# EAGLE design ANGEL II Type III_ver2 (EAGLE 7.4.0)
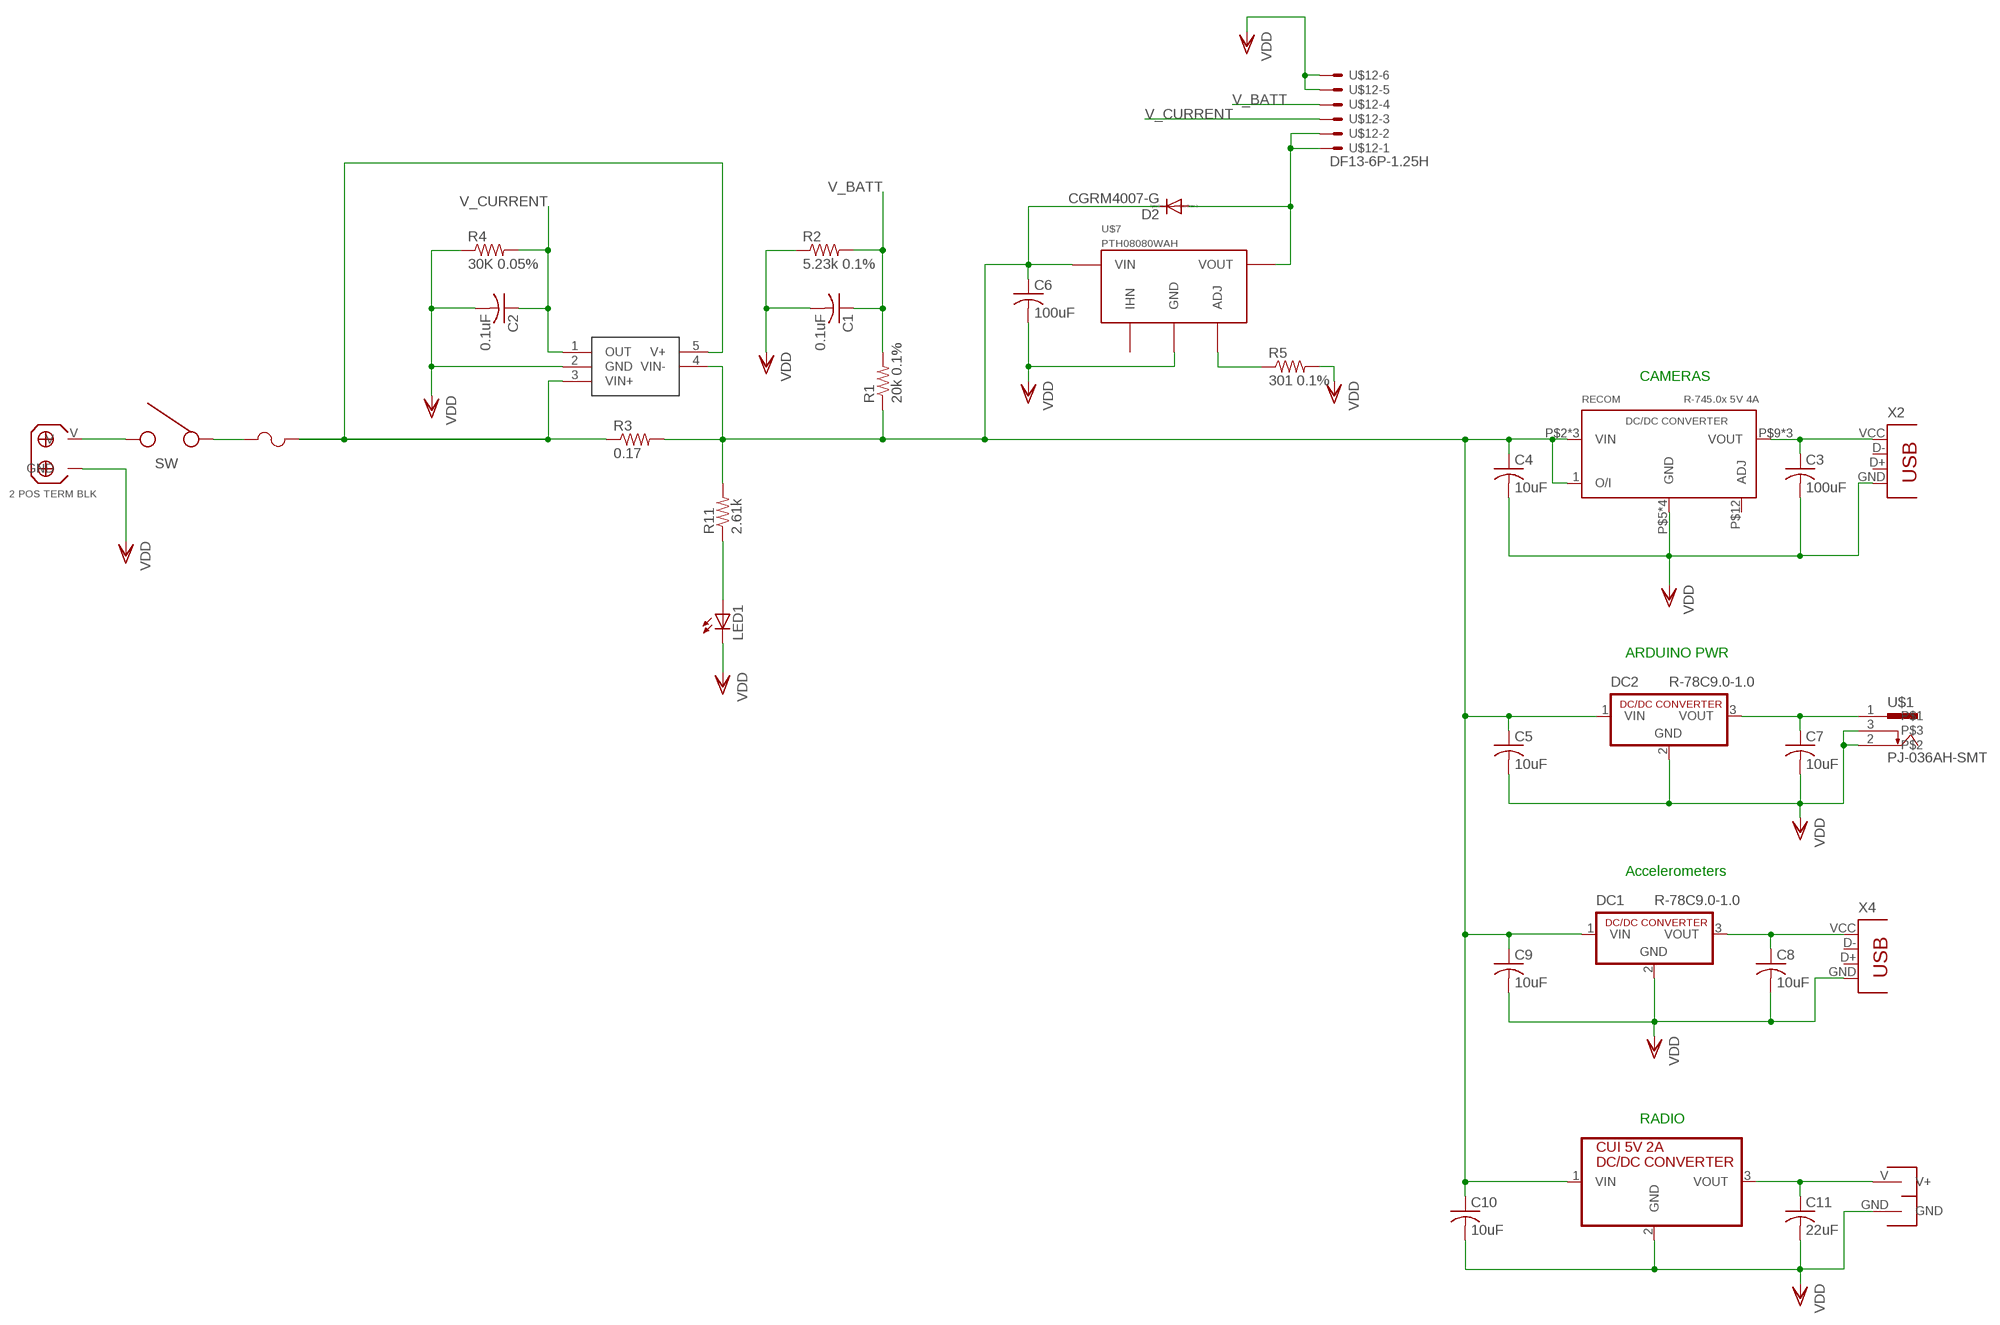
[diagram p0: schematic, sheet 1]

## Parts
C1  0.1uF  C-USC0603  [C0603]
C2  0.1uF  C-USC0603  [C0603]
C3  100uF  C-USC1210  [C1210]
C4  10uF  C-USC1206  [C1206]
C5  10uF  C-USC1206  [C1206]
C6  100uF  C-USC1210  [C1210]
C7  10uF  C-USC1206  [C1206]
C8  10uF  C-USC1206  [C1206]
C9  10uF  C-USC1206  [C1206]
C10  10uF  C-USC1206  [C1206]
C11  22uF  C-USC1210  [C1210]
D2  CGRM4007-G  [SOD-123_MINI-SMA]
DC1  R-78C9.0-1.0  [SIP3]
DC2  R-78C9.0-1.0  [SIP3]
LED1  LEDCHIPLED_0603  [CHIPLED_0603]
R1  20k 0.1%  R-US_R0603  [R0603]
R2  5.23k 0.1%  R-US_R0805  [R0805]
R3  0.17  R-US_R2512  [R2512]
R4  30K 0.05%  R-US_R0603  [R0603]
R5  301 0.1%  R-US_R0805  [R0805]
R11  2.61k  R-US_R0805  [R0805]
U$1  PJ-036AH-SMT  [SMT_DC_POWERJACK]
U$2  INA169  [SOT23-5]
U$5  CUI_DCDC_5V2A  [CUI_V200_DCDC]
U$6  SPST_ROCKER_SW  [ROCKER_SW_SPST]
U$7  PTH08080WAH  [PTH08080W_TH]
U$9  MOLEX_2POS_HEADRE_TB  [TERM_BLK_HDR_2POS_VERT_3P5MM]
U$10  2POS_TB_3.81MM  [2POS_TB_3P81MM]
U$11  LITTLEFUSE_1206SMT  [LITTLEFUSE_SMT]
U$12  DF13-6P-1.25H  [DF13A-6P-1.25H]
U$13  RECOM_R745_5V4A_DCDC  [12SIP_PIN]
X2  87583-2010BLF  [USB-A_87583-2010BLF]
X4  87583-2010BLF  [USB-A_87583-2010BLF]

## Nets
N$1: R3.1 U$2.3(VIN+) U$2.5(V+) U$11.P$3
N$4: C8.1 DC1.3(VOUT) X4.VCC
N$5: C11.1 U$5.3(VOUT) U$9.V(V+)
N$6: R5.1 U$7.4(ADJ)
N$7: C3.1 U$13.P$9(VOUT) U$13.P$10(VOUT) U$13.P$11(VOUT) X2.VCC
N$8: U$6.P$2 U$11.P$1
N$9: U$6.P$1 U$10.V
N$11: C7.1 DC2.3(VOUT) U$1.1
N$13: LED1.A R11.1
PIXHAWK_5V: D2.A U$7.3(VOUT) U$12.1 U$12.2
V_BATT: C1.1 R1.2 R2.2 U$12.4
V_CURRENT: C2.1 R4.2 U$2.1(OUT) U$12.3
VDD: C1.2 C2.2 C3.2 C4.2 C5.2 C6.2 C7.2 C8.2 C9.2 C10.2 C11.2 DC1.2(GND) DC2.2(GND) LED1.C R2.1 R4.1 R5.2 U$1.2 U$1.3 U$2.2(GND) U$5.2(GND) U$7.2(GND) U$9.GND U$10.GND U$12.5 U$12.6 U$13.P$5(GND) U$13.P$6(GND) U$13.P$7(GND) U$13.P$8(GND) X2.GND X4.GND
VIN: C4.1 C5.1 C6.1 C9.1 C10.1 D2.C DC1.1(VIN) DC2.1(VIN) R1.1 R3.2 R11.2 U$2.4(VIN-) U$5.1(VIN) U$7.1(VIN) U$13.1(O/I) U$13.P$2(VIN) U$13.P$3(VIN) U$13.P$4(VIN)
Unconnected: U$7.5(IHN) U$13.P$12(ADJ) X2.D+ X2.D- X4.D+ X4.D-

## Notes on the sheet
- CAMERAS
- ARDUINO PWR
- Accelerometers
- RADIO

## Library data of the parts
C1-C11 = rcl:C-US: CAPACITOR, American symbol
D2 = diode:CGRM400*-G: Molded plasitc,JEDEC SOD-123/Mini SMA Source: Comchip CGRM4001-G.pdf
DC1 DC2 = dc-dc-converter:R-78C*-1.0: INNOLINE DC/DC-Converter 1.0 AMP SIP3 Single Output Source: Data sheet <http://www.mikrocontroller.net/attachment/150645/157764-da-01-en-DC_DC_WANDLER_R_78C5_0_1_0.pdf>
LED1 = led:LED: LED OSRAM: - CHIPLED LG R971, LG N971, LY N971, LG Q971, LY Q971, LO R971, LY R971 LH N974, LH R974 LS Q976, LO Q976, LY Q976 LO Q996 - Hyper CHIPLED LW Q18S LB Q993, LB Q99A, LB R99A - SideLED LS A670, LO A670, LY A670, LG A670, LP A670 LB A673, LV A673, LT A673, LW A673 LH A674 LY A675 LS A676, LA A676, LO A676, LY A676, LW A676 LS A679, LY A679, LG A679 - Hyper Micro SIDELED® LS Y876, LA Y876, LO Y876, LY Y876 LT Y87S - SmartLED LW L88C, LW L88S LB L89C, LB L89S, LG L890 LS L89K, LO L89K, LY L89K LS L896, LA L896, LO L896, LY L896 - TOPLED LS T670, LO T670, LY T670, LG T670, LP T670 LSG T670, LSP T670, LSY T670, LOP T670, LYG T670 LG T671, LOG T671, LSG T671 LB T673, LV T673, LT T673, LW T673 LH T674 LS T676, LA T676, LO T676, LY T676, LB T676, LH T676, LSB T676, LW T676 LB T67C, LV T67C, LT T67C, LS T67K, LO T67K, LY T67K, LW E67C LS E67B, LA E67B, LO E67B, LY E67B, LB E67C, LV E67C, LT E67C LW T67C LS T679, LY T679, LG T679 LS T770, LO T770, LY T770, LG T770, LP T770 LB T773, LV T773, LT T773, LW T773 LH T774 LS E675, LA E675, LY E675, LS T675 LS T776, LA T776, LO T776, LY T776, LB T776 LHGB T686 LT T68C, LB T68C - Hyper Mini TOPLED® LB M676 - Mini TOPLED Santana® LG M470 LS M47K, LO M47K, LY M47K Source: http://www.osram.convergy.de LUXEON: - LUMILED® LXK2-PW12-R00, LXK2-PW12-S00, LXK2-PW14-U00, LXK2-PW14-V00 LXK2-PM12-R00, LXK2-PM12-S00, LXK2-PM14-U00 LXK2-PE12-Q00, LXK2-PE12-R00, LXK2-PE12-S00, LXK2-PE14-T00, LXK2-PE14-U00 LXK2-PB12-K00, LXK2-PB12-L00, LXK2-PB12-M00, LXK2-PB14-N00, LXK2-PB14-P00, LXK2-PB14-Q00 LXK2-PR12-L00, LXK2-PR12-M00, LXK2-PR14-Q00, LXK2-PR14-R00 LXK2-PD12-Q00, LXK2-PD12-R00, LXK2-PD12-S00 LXK2-PH12-R00, LXK2-PH12-S00 LXK2-PL12-P00, LXK2-PL12-Q00, LXK2-PL12-R00 Source: www.luxeon.com KINGBRIGHT: KA-3528ASYC Source: www.kingbright.com
R1-R5 R11 = rcl:R-US_: RESISTOR, American symbol
U$1 = CUSTOM:PJ-036AH-SMT: Power Jack, Right Angle, PCB Surface Mount, 2.0 mm Center Pin Source: http://www.cui.com/product/resource/pj-036ah-smt.pdf
U$2 = SparkFun:INA169
U$5 = CUSTOM:CUI_DCDC_5V2A
U$6 = CUSTOM:SPST_ROCKER_SW
U$7 = pixhawk2:PTH08080W: 2.25-A, WIDE-INPUT ADJUSTABLE SWITCHING REGULATOR The input voltage range of the PTH08080W is from 4.5 V to 18 V, allowing operation from either a 5-V or 12-V input bus. Using state-of-the-art switched-mode power-conversion technology, the PTH08080W can step down to voltages as low as 0.9 V from a 5-V input bus, with less than 1 W of power dissipation. The output voltage can be adjusted to any voltage over the range, 0.9 V to 5.5 V, using a single external resistor. Operating features include an undervoltage lockout (UVLO), on/off inhibit, overcurrent protection, and overtemperature protection. http://focus.ti.com/lit/ds/symlink/pth08080w.pdf
U$9 = CUSTOM:MOLEX_2POS_HEADRE_TB
U$10 = CUSTOM:2POS_TB_3.81MM
U$11 = CUSTOM:LITTLEFUSE_1206SMT
U$12 = pixhawk2:DF13-6P-1.25?
U$13 = CUSTOM:RECOM_R745_5V4A_DCDC
X2 X4 = CUSTOM:87583-2010BLF: FCi Surface mount USB connector

## Board
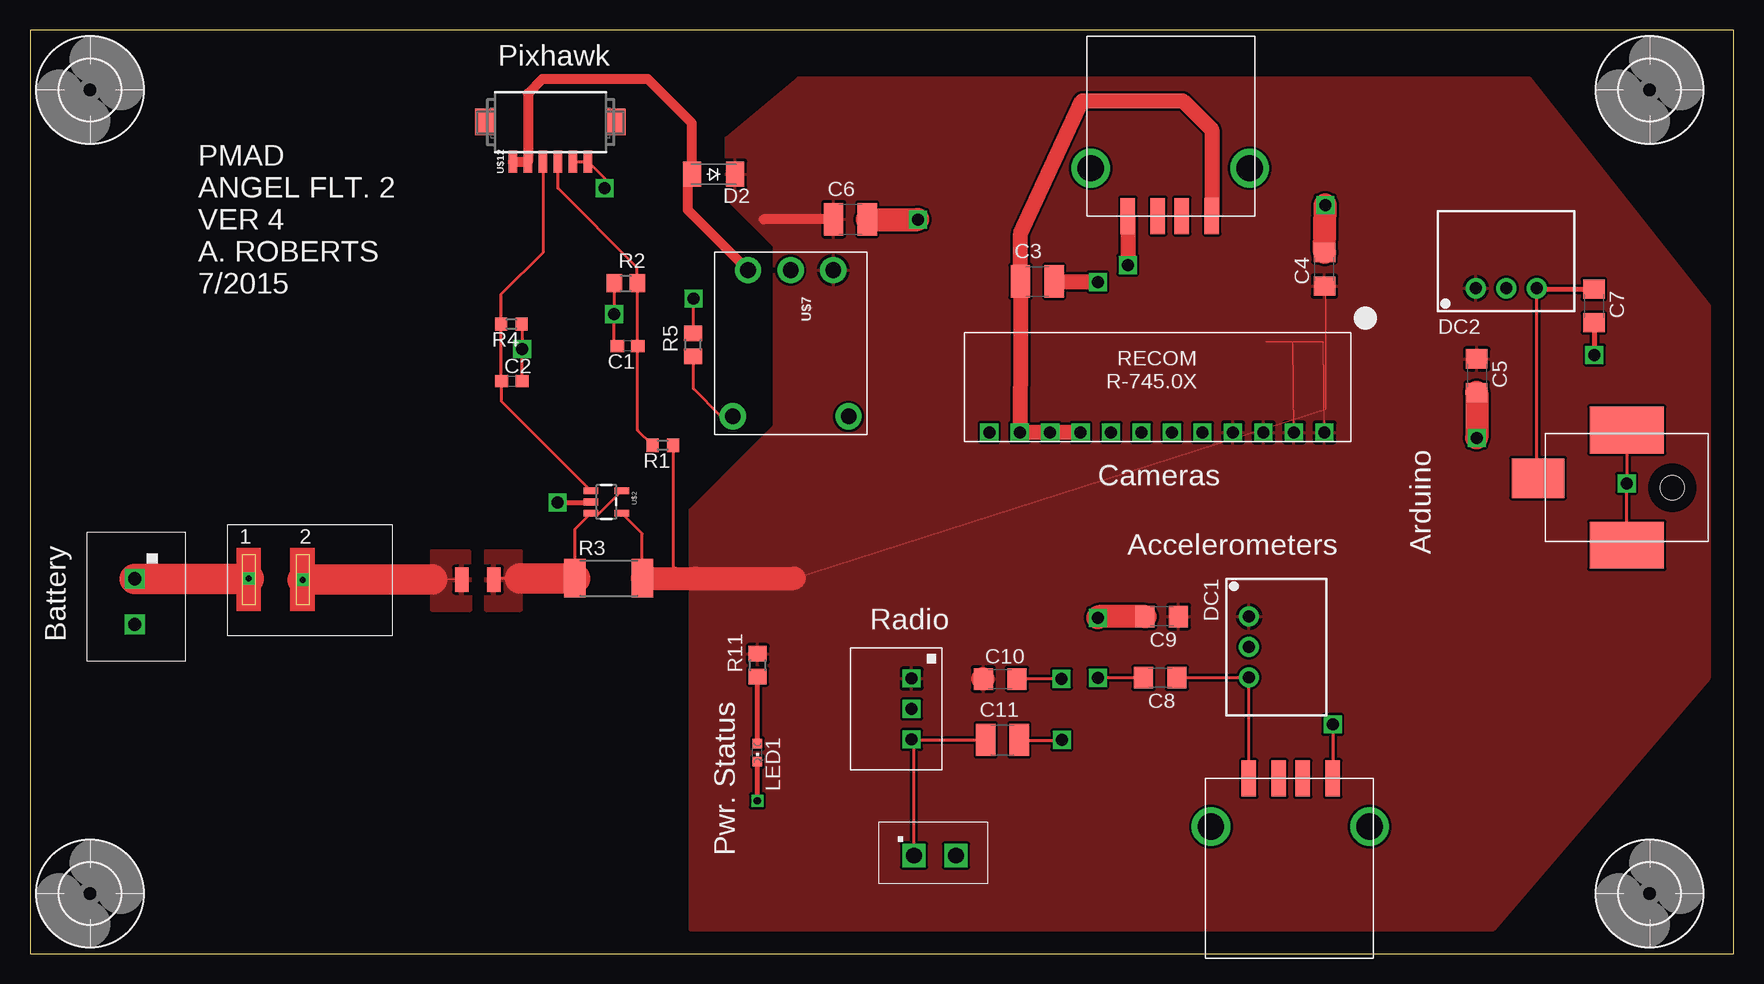
[diagram p1: board, top side]
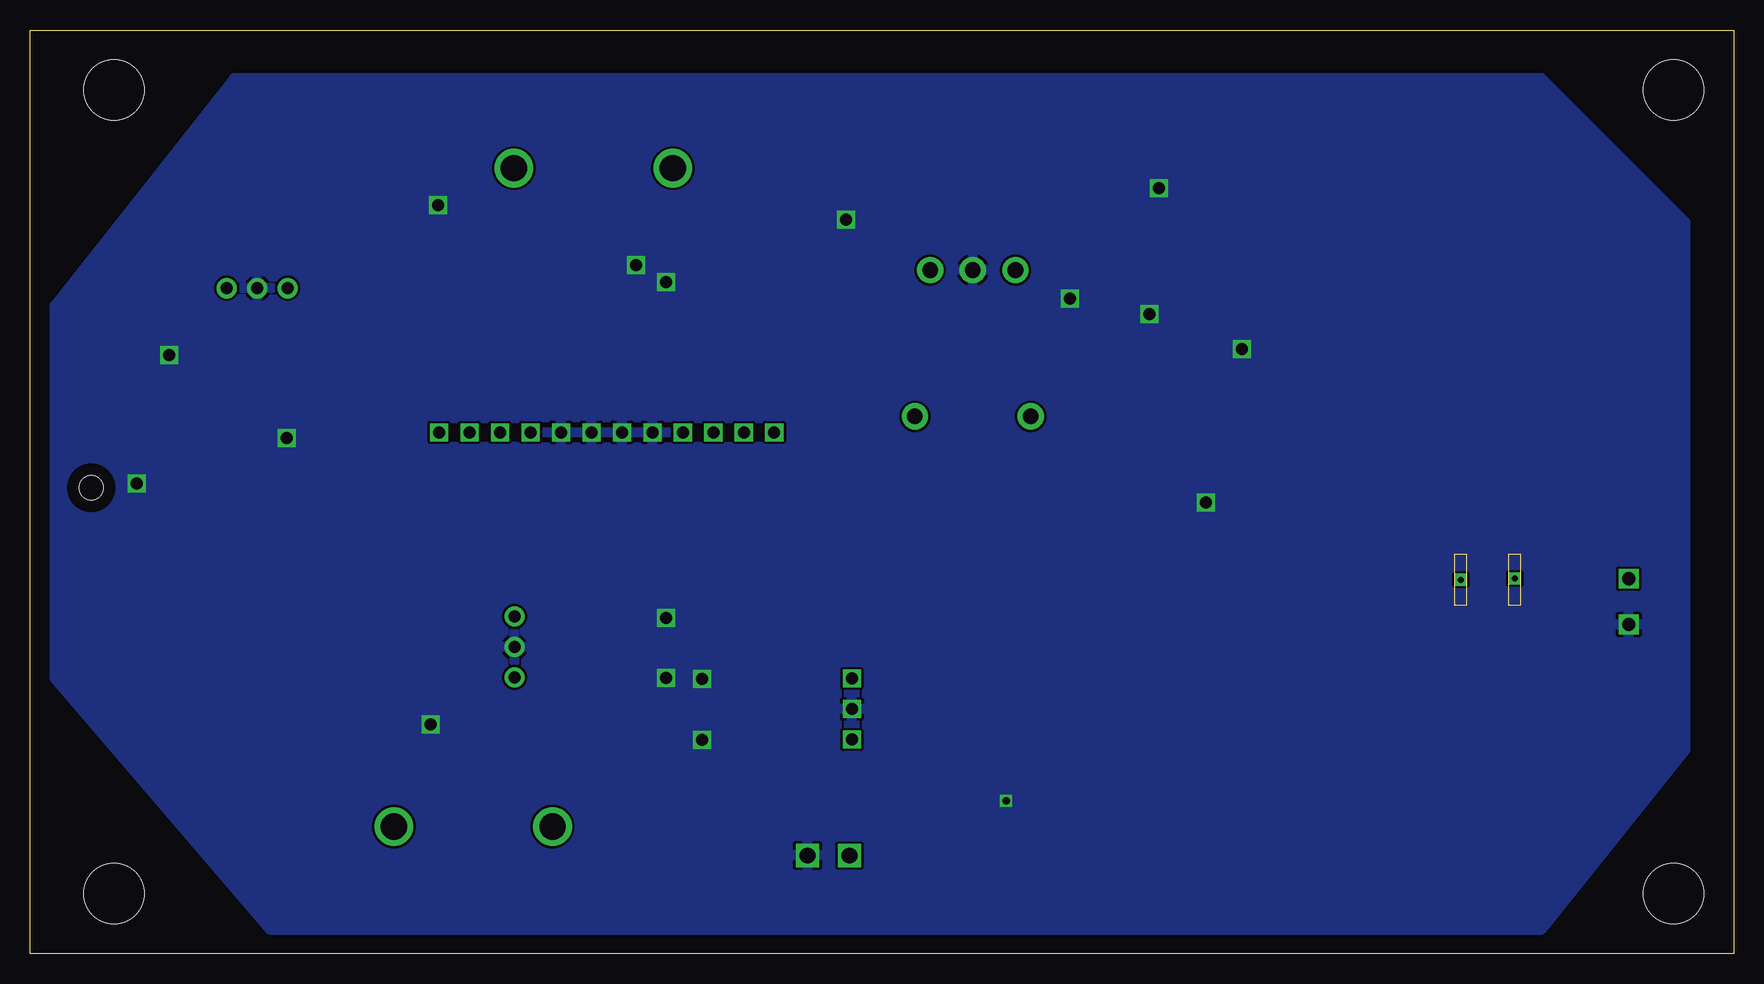
[diagram p2: board, bottom side, seen from below]

Size 142 x 77 mm. Coordinates in mm from the lower left corner, seen from the top.
Outline: 0,0 142,0 142,77 0,77 0,0
Copper layers (1*16): Top 0.035mm / dielectric 1.5mm / Bottom 0.035mm
Design rules "default": minimum track width 10mil, minimum drill 24mil, track to track 8mil, track to pad 8mil, pad to pad 8mil, via to via 8mil, smd to smd 8mil, copper to edge 40mil, drill to drill 8mil, minimum pad ring 10mil, minimum via ring 8mil, stop-mask expansion 4mil, vias tented up to drill 0mil, thermal gap 10mil

### Footprints (pad centres in the part's own frame; a part is rotated, then mirrored left to right if it is on the bottom)
C0603 = smd 1.1 x 1: 1 -0.85,0; 2 0.85,0
C1210 = smd 1.6 x 2.7: 1 -1.4,0; 2 1.4,0
C1206 = smd 1.6 x 1.8: 1 -1.4,0; 2 1.4,0
SOD-123_MINI-SMA = smd 1.5 x 2.1: A 1.8,0; C -1.8,0
SIP3 = drill 1 pad 1.676: 1 -2.54,0; 2 0,0; 3 2.54,0
CHIPLED_0603 = smd 0.8 x 0.8: A 0,-0.75; C 0,0.75
R0603 = smd 1 x 1.1: 1 -0.85,0; 2 0.85,0
R0805 = smd 1.3 x 1.5: 1 -0.95,0; 2 0.95,0
R2512 = smd 1.8 x 3.2: 1 -2.8,0; 2 2.8,0
SMT_DC_POWERJACK = smd 4.4 x 3.3: 1 14.2,3.7 | smd 6.2 x 3.9: 2 6.8,9.3; 3 6.8,-0.3 | hole 2: 3,4.5
SOT23-5 = smd 0.55 x 1.2: 1 -0.95,-1.3; 2 0,-1.3; 3 0.95,-1.3; 4 0.95,1.3; 5 -0.95,1.3
5,0 = hole 5: 0,0
CUI_V200_DCDC = drill 1 square: 1 -2.54,0; 2 0,0; 3 2.54,0
ROCKER_SW_SPST = drill 0.5 square: P$1 -4.542,0.184; P$2 -0.046,0.083
PTH08080W_TH = drill 1.3 pad 2.184: 1 -6.096,3.556; 2 -6.096,0; 3 -6.096,-3.556; 4 6.096,-4.826; 5 6.096,4.826
TERM_BLK_HDR_2POS_VERT_3P5MM = drill 1.3 square: GND 1.75,0; V -1.75,0
2POS_TB_3P81MM = drill 1.1 square: GND 1.905,0; V -1.905,0
LITTLEFUSE_SMT = smd 1.14 x 2.03: P$1 1.34,0; P$3 -1.33,0
DF13A-6P-1.25H = smd 0.7 x 1.8: 1 -3.125,-3.3; 2 -1.875,-3.3; 3 -0.625,-3.3; 4 0.625,-3.3; 5 1.875,-3.3; 6 3.125,-3.3 | smd 1.6 x 2.2: S1 5.475,0; S2 -5.475,0
12SIP_PIN = drill 1 square: 1 0,7.62; P$2 2.54,7.62; P$3 5.08,7.62; P$4 7.62,7.62; P$5 10.16,7.62; P$6 12.7,7.62; P$7 15.24,7.62; P$8 17.78,7.62; P$9 20.32,7.62; P$10 22.86,7.62; P$11 25.4,7.62; P$12 27.94,7.62
USB-A_87583-2010BLF = drill 2.2: CASE_GND -6.65,3; CASE_GND2 6.59,3 | smd 1.2 x 3: D+ 1,7; D- -1,7; GND 3.5,7; VCC -3.5,7

### Placement (x,y rotation side)
C1  49.81,50.65 180 top
C2  40.16,47.73 0 top
C3  83.97,56.04 0 top
C4  107.91,57.05 90 top
C5  120.59,48.18 270 top
C6  68.39,61.22 0 top
C7  130.36,53.99 270 top
C8  94.21,22.99 180 top
C9  94.34,28.09 180 top
C10  80.87,22.89 0 top
C11  81.06,17.81 0 top
D2  56.98,64.98 180 top
DC1  101.62,25.55 270 top
DC2  123.05,55.46 0 top
LED1  60.64,16.75 180 top
R1  52.75,42.38 180 top
R2  49.66,55.88 0 top
R3  48.23,31.29 0 top
R4  40.13,52.48 180 top
R5  55.27,50.75 90 top
R11  60.66,24.04 90 top
U$1  139.9,43.34 180 top
U$2  48.04,37.65 270 top
U$3  [5,0]  135,72 0 top
U$4  [5,0]  5,72 0 top
U$5  73.49,20.39 270 top
U$6  22.77,31.08 0 top
U$7  63.41,50.88 270 top
U$8  [5,0]  5,5 0 top
U$9  75.44,8.17 0 top
U$10  8.74,29.34 270 top
U$11  37.33,31.17 180 top
U$12  43.39,69.32 0 top
U$13  107.9,51.07 180 top
U$14  [5,0]  135,5 0 top
X2  95.01,68.48 180 top
X4  105.09,7.6 0 top

### Tracks (layer width: path | path; a pad name or v marks a point on that pad's centre or on a via)
N$1
  Top 0.254: 40.86,31.25 38.66,31.25 U$11.P$3 | R3.1 45.43,35.39 U$2.3 47.44,36.7 U$2.5
  Top 2.54: R3.1 40.86,31.29 40.86,31.25
  pour Top: 38,33.5 38,28.7 40.9,28.7 40.9,33.5
N$4
  Top 0.254: C8.1 95.63,23.01 DC1.3 101.62,14.63 X4.VCC
N$5
  Top 0.254: C11.1 73.53,17.81 U$5.3 73.69,17.65 U$9.V
N$6
  Top 0.254: U$7.4 57.62,44.78 55.3,47.1 55.3,49.77 R5.1
N$7
  Top 1.27: U$13.P$9 U$13.P$10 U$13.P$11 82.57,51.14 C3.1 82.57,60.03 87.7,71.1 96.1,71.1 98.51,68.69 X2.VCC
N$8
  Top 0: U$11.P$1 35.96,31.2 33.5,31.2
  Top 2.54: U$6.P$2 22.76,31.2 33.5,31.2
  pour Top: 36.7,28.7 36.6,33.5 33.5,33.5 33.5,28.7
N$9
  Top 2.54: U$10.V 18.23,31.25 U$6.P$1
N$11
  Top 0.254: U$1.1 125.59,39.75 DC2.3 125.65,55.4
  Top 0.406: 125.65,55.4 C7.1
N$13
  Top 0.406: LED1.A 60.66,17.5 R11.1
PIXHAWK_5V
  Top 0.813: U$12.1 U$12.2 41.5,66.03 41.5,71.7 42.7,72.9 51.5,72.9 55.18,69.22 D2.A 54.85,64.64 54.85,61.98 U$7.3
V_BATT
  Top 0.254: U$12.4 44,66 44,63.8 50.61,57.19 R2.2 50.61,50.7 C1.1 50.66,43.62 R1.2
V_CURRENT
  Top 0.254: 42.7,65.95 U$12.3 42.8,65.98 42.8,58.5 39.28,54.98 R4.2 39.28,47.76 C2.1 39.31,46.03 U$2.1
VDD  (via drill 0.6, 1)
  Top 0.254: C2.2 v41,50.4 41,52.48 R4.1 | C1.2 48.7,50.65 v48.7,53.3 R2.1 | U$12.5 U$12.6 47.9,64.64 v47.9,63.8 | R5.2 55.3,51.73 v55.3,54.6 | v74,61.2 73.98,61.22 | 133.1,45.3 U$1.3 v133.1,39.2 U$1.2 | C11.2 82.5,17.77 85.97,17.77 v86,17.8 | C8.2 v89.01,22.99 v89,23 | v108.6,19.1 X4.GND | v85.98,22.9 82.29,22.9 arc45 C10.2
  Top 0.406: v43.98,37.62 46.74,37.62 U$2.2 | C7.2 130.4,52.59 v130.4,49.9 | v60.63,12.73 v60.64,12.73 LED1.C
  Top 1.27: C3.2 88.96,56.04 v89,56 | X2.GND v91.51,57.41 v91.5,57.4
  Top 1.93: C5.2 v120.59,43.01 v120.6,43 | C4.2 v107.98,62.41 | C9.2 89.09,28.09 v89,28 | C6.2 69.81,61.2 v74,61.2
  pour Bottom: 16,73 125,73 140,54 140,23 122,2 16,2 4,17 4,61
VIN
  Top 0: 63.7,31.29 108,45.41 108,55.56 C4.1 | U$13.1 107.83,51 105,51 | U$13.P$2 105.29,51 103,51
  Top 0.254: R3.2 51.03,35.01 U$2.4 | 55.38,31.41 55.5,31.29 | R1.1 53.6,30.9
  Top 0.305: 53.6,31.19 53.7,31.29
  Top 0.406: 53.6,30.9 53.6,31.19
  Top 0.813: 66.97,61.2 C6.1 61.18,61.22
  Top 1.93: R3.2 53.7,31.29 55.5,31.29 63.7,31.29 | 79.43,22.93 C10.1
  pour Top: 55,37 55,2 122,2 140,23 140,54 125,73 64,73 58,68 58,63 62,59 62,44

### Text on the board
_tsilk: Pixhawk | PMAD / ANGEL FLT. 2 / VER 4 / A. ROBERTS / 7/2015 | Arduino | Cameras | Accelerometers | Radio | Battery | Pwr. Status